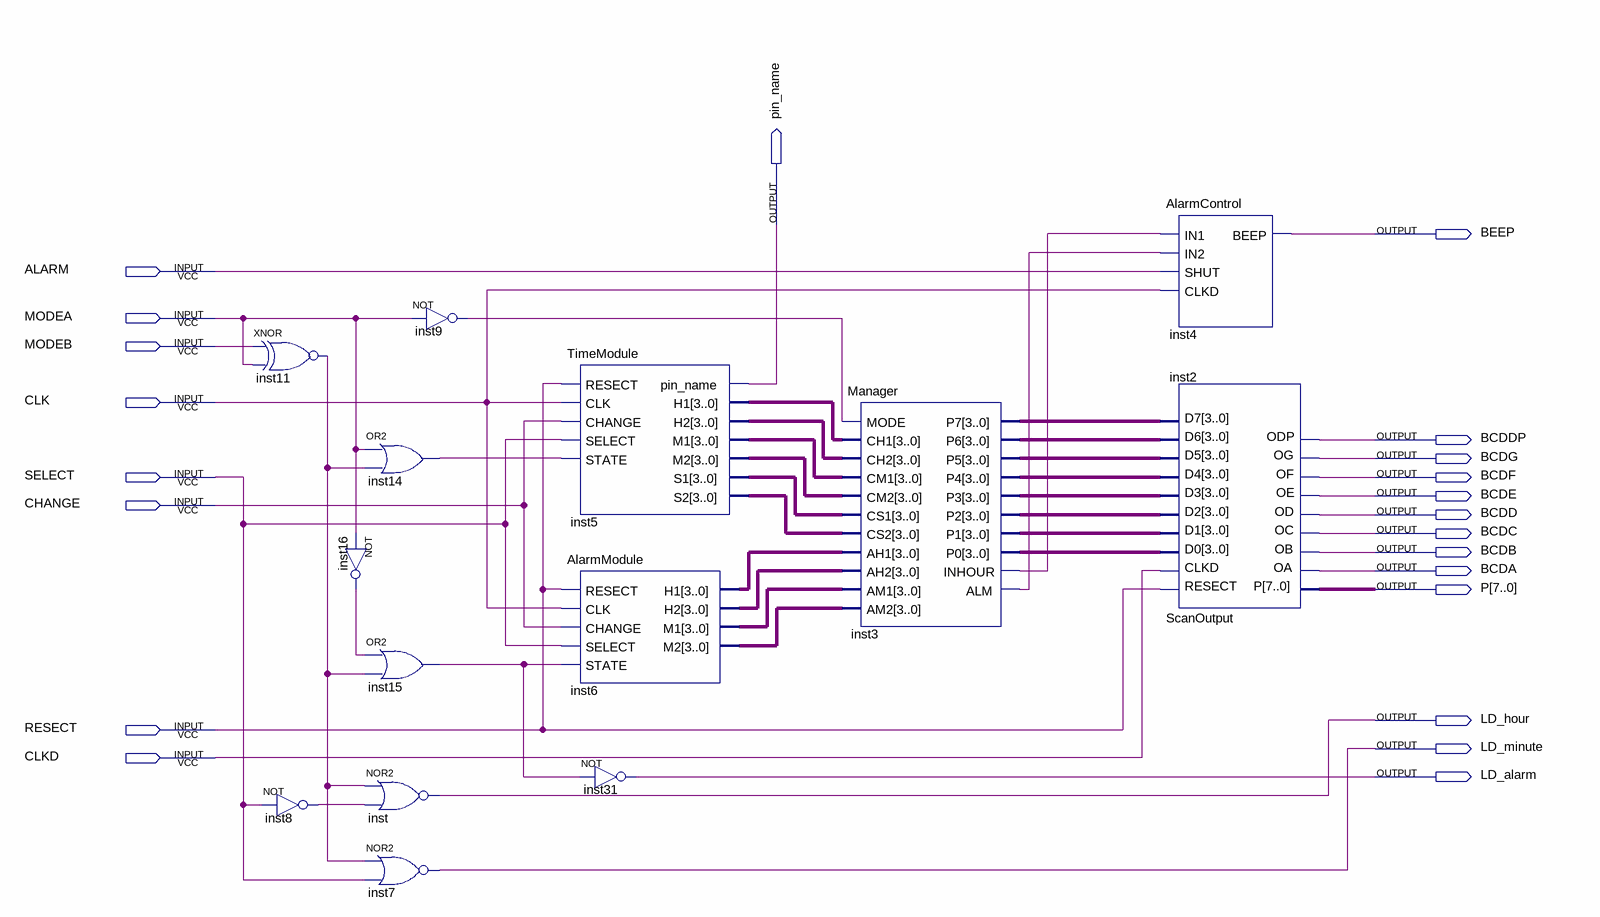
[diagram p0: schematic sheet]
// Quartus schematic DigitalClock.bdf as structural Verilog: 14 symbols, 22 pins
module DigitalClock (
  input  ALARM,
  input  MODEA,
  input  MODEB,
  input  CLK,
  input  SELECT,
  input  CHANGE,
  input  RESECT,
  input  CLKD,
  output pin_name,
  output BEEP,
  output BCDDP,
  output BCDG,
  output BCDF,
  output BCDE,
  output BCDD,
  output BCDC,
  output BCDB,
  output BCDA,
  output [7:0] P,
  output LD_hour,
  output LD_minute,
  output LD_alarm
);

  wire inst3_alm, inst3_inhour, inst8_out, inst9_out, inst11_out, inst14_out, inst15_out, inst16_out;
  wire [3:0] inst3_p0, inst3_p1, inst3_p2, inst3_p3, inst3_p4, inst3_p5, inst3_p6, inst3_p7, inst5_h1,
       inst5_h2, inst5_m1, inst5_m2, inst5_s1, inst5_s2, inst6_h1, inst6_h2, inst6_m1, inst6_m2;

  xnor inst11 (inst11_out, MODEB, MODEA);
  not inst8 (inst8_out, SELECT);
  or inst14 (inst14_out, MODEA, inst11_out);
  not inst16 (inst16_out, MODEA);
  or inst15 (inst15_out, inst16_out, inst11_out);
  nor inst (LD_hour, inst11_out, inst8_out);
  nor inst7 (LD_minute, inst11_out, SELECT);
  not inst9 (inst9_out, MODEA);
  TimeModule inst5 (
    .RESECT(RESECT), .CLK(CLK), .CHANGE(CHANGE), .SELECT(SELECT), .STATE(inst14_out), .pin_name(pin_name),
    .H1(inst5_h1), .H2(inst5_h2), .M1(inst5_m1), .M2(inst5_m2), .S1(inst5_s1), .S2(inst5_s2));
  AlarmModule inst6 (
    .RESECT(RESECT), .CLK(CLK), .CHANGE(CHANGE), .SELECT(SELECT), .STATE(inst15_out), .H1(inst6_h1),
    .H2(inst6_h2), .M1(inst6_m1), .M2(inst6_m2));
  not inst31 (LD_alarm, inst15_out);
  Manager inst3 (
    .MODE(inst9_out), .CH1(inst5_h1), .CH2(inst5_h2), .CM1(inst5_m1), .CM2(inst5_m2), .CS1(inst5_s1),
    .CS2(inst5_s2), .AH1(inst6_h1), .AH2(inst6_h2), .AM1(inst6_m1), .AM2(inst6_m2), .P7(inst3_p7),
    .P6(inst3_p6), .P5(inst3_p5), .P4(inst3_p4), .P3(inst3_p3), .P2(inst3_p2), .P1(inst3_p1), .P0(inst3_p0),
    .INHOUR(inst3_inhour), .ALM(inst3_alm));
  AlarmControl inst4 (.IN1(inst3_inhour), .IN2(inst3_alm), .SHUT(ALARM), .CLKD(CLK), .BEEP(BEEP));
  ScanOutput inst2 (
    .RESECT(RESECT), .CLKD(CLKD), .D0(inst3_p0), .D1(inst3_p1), .D2(inst3_p2), .D3(inst3_p3), .D4(inst3_p4),
    .D5(inst3_p5), .D6(inst3_p6), .D7(inst3_p7), .P(P), .OA(BCDA), .OB(BCDB), .OC(BCDC), .OD(BCDD),
    .OE(BCDE), .OF(BCDF), .OG(BCDG), .ODP(BCDDP));
endmodule
